# Altium schematic sheet Microphone.SchDoc
size 420 x 297 mm; SheetNumber: 5; SheetTotal: 10; PageSetup: Record=PageOptions|CenterHorizontal=True|CenterVertical=True|PrintScale=0.96|XCorrection=1.00|YCorrection=1.00|PrintKind=1|BorderSize=5000000|LeftOffset=0|BottomOffset=0|Orientation=2|PaperLength=4318|PaperWidth=2794|Scale=100|PaperSource=7|PrintQuality=600|MediaType=1|DitherType=10|PaperKind=11" x 17"|PrintScaleMode=1
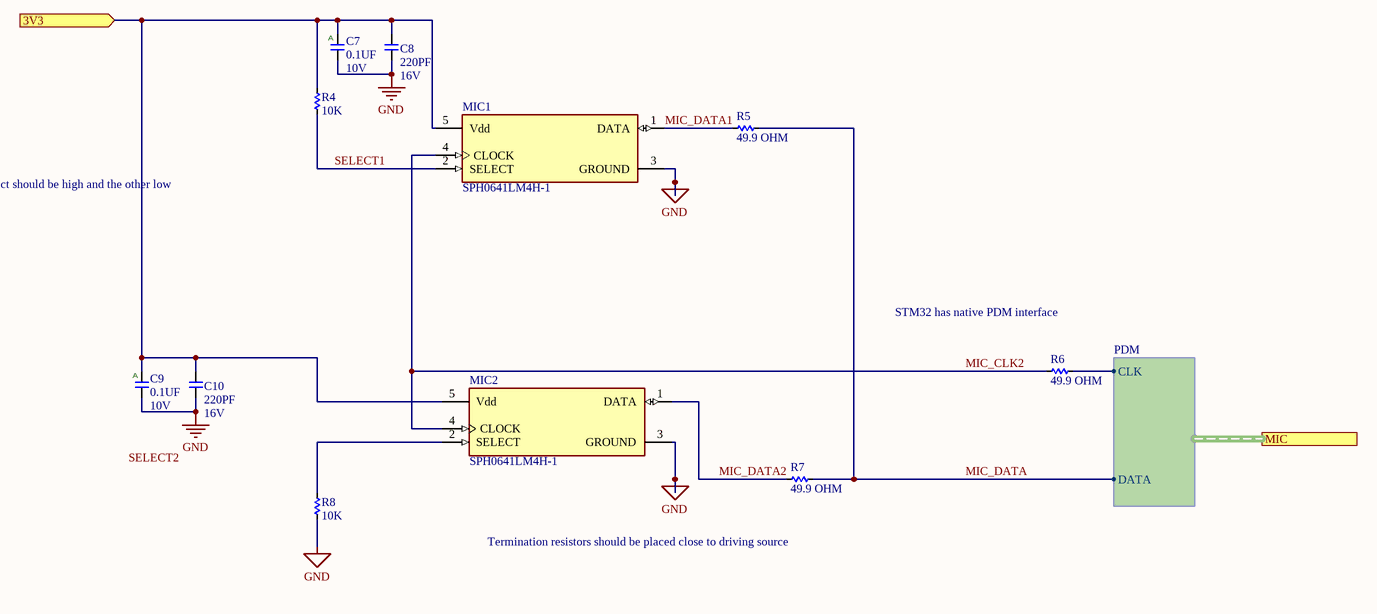
[diagram p0: Microphone.SchDoc]

## Parts
C7  value 0.1UF  Voltage: 10V  [C0201Y]  (hidden comment: __Template_Cap_Auto)
C8  value 220PF  Voltage: 16V  [C0201Y]  (hidden comment: __Template_Cap)
C9  value 0.1UF  Voltage: 10V  [C0201Y]  (hidden comment: __Template_Cap_Auto)
C10  value 220PF  Voltage: 16V  [C0201Y]  (hidden comment: __Template_Cap)
MIC1  SPH0641LM4H-1  [FP-SPH0641LM4H-1-MFG]
MIC2  SPH0641LM4H-1  [FP-SPH0641LM4H-1-MFG]
R4  value 10K  [R0201_H0.26MM]  (hidden comment: __Template_Resistor)
R5  value 49.9 OHM  [R0201_H0.26MM]  (hidden comment: __Template_Resistor)
R6  value 49.9 OHM  [R0201_H0.26MM]  (hidden comment: __Template_Resistor)
R7  value 49.9 OHM  [R0201_H0.26MM]  (hidden comment: __Template_Resistor)
R8  value 10K  [R0201_H0.26MM]  (hidden comment: __Template_Resistor)

## Ports
3V3 (in), MIC (harness PDM)

## Harnesses
PDM: DATA, CLK

## Nets
GND: C7.2 C8.2 C9.2 C10.2 MIC1.3(GROUND) MIC2.3(GROUND) R8.1
3V3: C7.1 C8.1 C9.1 C10.1 MIC1.5(Vdd) MIC2.5(Vdd) R4.2 ; port 3V3
MIC_CLK2: MIC1.4(CLOCK) MIC2.4(CLOCK) R6.1
MIC_DATA: R5.2 R7.2 ; port MIC.DATA
MIC_DATA1: MIC1.1(DATA) R5.1
MIC_DATA2: MIC2.1(DATA) R7.1
SELECT1: MIC1.2(SELECT) R4.1
NetMIC2_2: MIC2.2(SELECT) R8.2
NetR6_2: R6.2 ; port MIC.CLK

## Notes on the sheet
- (near MIC1) One Select should be high and the other low
- STM32 has native PDM interface
- Termination resistors should be placed close to driving source
- Labels drawn without touching a wire or pin: SELECT2
- CREATIVE COMMONS
- PUBLIC LICENSE:
- BARKOUR ROBOT
- CC BY-NC 4.0
- APPROVED
- DWG NO
- GOOGLE LLC
- FILE
- RELEASED
- 2024/05/09
- SIZE
- 1600 AMPHITHEATRE PARKWAY
- MOUNTAIN VIEW CA 94043
- A3
- SHEET
- OF
- THIS DESIGN IS BEING PROVIDED  FOR NON-COMMERCIAL USE ONLY. THE USE OF =SCIENTIST_NAME_POSSESSIVE NAME IN CONNECTION WITH THE DESIGN IS NOT INTENDED TO IMPLY THAT =SCIENTIST_NAME SPONSORS OR ENDORSES THE DESIGN, GOOGLE LLC, OR ANY OF GOOGLE LLC'S PRODUCTS OR SERVICES.
- (in symbol 934) A

## Library data of the parts
C7 C9 = 934: CAP, CER, X6S, 0.1uF, 10V, 10%, 0201, AUTOGRADE; ID: 934; MFG: MURATA; MFG P/N: GRT033C81A104KE01D; XPN: 150-01178-00; Gecko: 150-04546-00; EES: 150-04563-00; Status: Released; Package: 0201; Dielectric: X6S; Tolerance: 10%; Height: 0.33mm T; Supplier 1: Digi-key; HelpURL: https://www.digikey.com/product-detail/en/murata-electronics/GRT033C81A104KE01D/490-12232-1-ND/5416933; ComponentLink1Description: Datasheet; ComponentLink1URL: https://search.murata.co.jp/Ceramy/image/img/A01X/G101/ENG/GRT033C81A104KE01-01.pdf; COMMON: 150-01178-00; LOON: 150-01178-00; Supplier Part Number 1: 490-12232-1-ND
C8 C10 = 156: CAP, CER, X7R, 220pF, 16V, 10%, 0201, 0.33mm T; ID: 156; MFG: MURATA; MFG P/N: GRM033R71C221KA01D; XPN: 150-00794-00; EES: 150-04568-00; Status: Released; Package: 0201; Dielectric: X7R; Tolerance: 10%; Height: 0.33mm T; ComponentLink1Description: Datasheet; COMMON: 150-00794-00; LOON: 150-00794-00; Gecko: 150-00794-00
MIC1 MIC2 = CMP-95043-000005-1: MORELLO MIC MULTIMODE DGT BOT PT; Operating Supply Current: 700uA; Direction: Omnidirectional; Output Type: Digital; Shape: Rectangular; Height: 1.08mm; Series: SiSonic™ SPH; Packaging: Cut Tape; Termination: Solder; Width: 2.65mm; RoHS Compliant: Yes; Length: 3.5mm
R4 R8 = 6783: RES, 10K, 1%, 1/20W, 0201, AUTOGRADE; ID: 6783; MFG: PANASONIC; MFG P/N: ERJ1GNF1002C; COMMON: 470-00033-00; PROXY: Use ID #4151; EES: 470-18014-00; Status: Released; Package: 0201; Power: 1/20W; Tolerance: 1%; Height: 0.26mm; Supplier 1: Digi-Key; HelpURL: https://www.digikey.in/product-detail/en/panasonic-electronic-components/ERJ-1GNF1002C/P122414CT-ND/7389440; ComponentLink1Description: Datasheet; ComponentLink1URL: https://industrial.panasonic.com/cdbs/www-data/pdf/RDA0000/AOA0000C304.pdf; LOON: 470-00033-00; Gecko: 470-00033-00; XPN: 470-00033-00; Supplier Part Number 1: P122414CT-ND
R5-R7 = 10006: RES, 49.9, 1%, 1/20W, 0201, AUTOGRADE; ID: 10006; MFG: Panasonic Electronic Components; MFG P/N: ERJ-1GNF49R9C; Catagory: Chip Resistor - Surface Mount; Power: 0.05W, 1/20W; EES: 470-18006-00; Status: Released; Package: 0201; Tolerance: 1%; Height: 0.26mm; Supplier 1: Digi-Key; HelpURL: https://www.digikey.in/product-detail/en/panasonic-electronic-components/ERJ-1GNF49R9C/P123049CT-ND/8343037; ComponentLink1Description: Datasheet; ComponentLink1URL: https://industrial.panasonic.com/cdbs/www-data/pdf/RDA0000/AOA0000C304.pdf; Supplier Part Number 1: P123049CT-ND